# EAGLE design RomeBoardV1.1B (EAGLE 8.6.0)

## Sheet 1 of 4: Power and Regulation
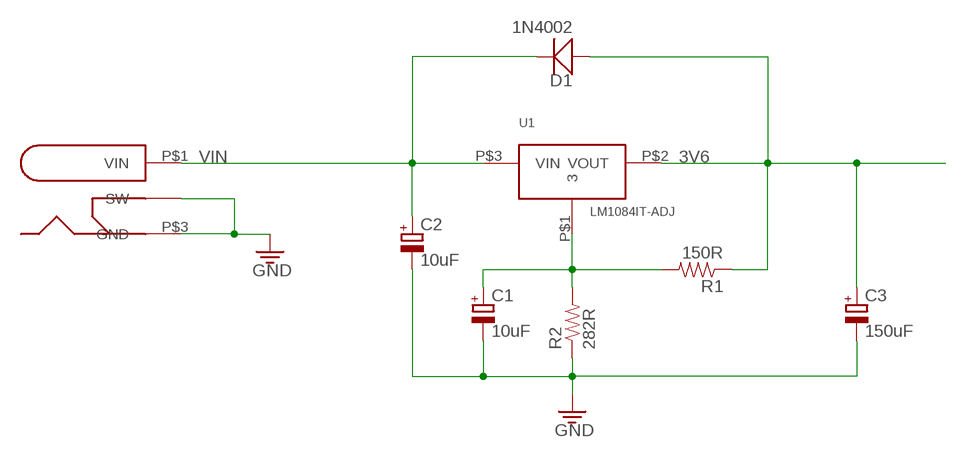
[diagram p0: schematic, sheet 1]

### Parts
C1  10uF  CPOL-EUE2.5-7  [E2,5-7]
C2  10uF  CPOL-EUE2.5-7  [E2,5-7]
C3  150uF  CPOL-EUE5-13  [E5-13]
D1  1N4002  [DO-201AD]
R1  150R  RESISTOR-PTH0.4  [AXIAL-0.4]
R2  282R  RESISTOR-PTH0.4  [AXIAL-0.4]
U1  LM1084IT-ADJ  [TO-220-507302B00000G]
U$2  PJ-002A  [PJ-002A]

### Nets
3V6: C3.+ D1.P$1(A) R1.1 U1.P$2(VOUT) ; also sheet 2,3
GND: C1.- C2.- C3.- R2.1 U$2.P$2(SW) U$2.P$3(GND) ; also sheet 2,3,4
N$8: C1.+ R1.2 R2.2 U1.P$1
VIN: C2.+ D1.P$2(C) U1.P$3(VIN) U$2.P$1(VIN) ; also sheet 2,3,4

## Sheet 2 of 4: Connectors
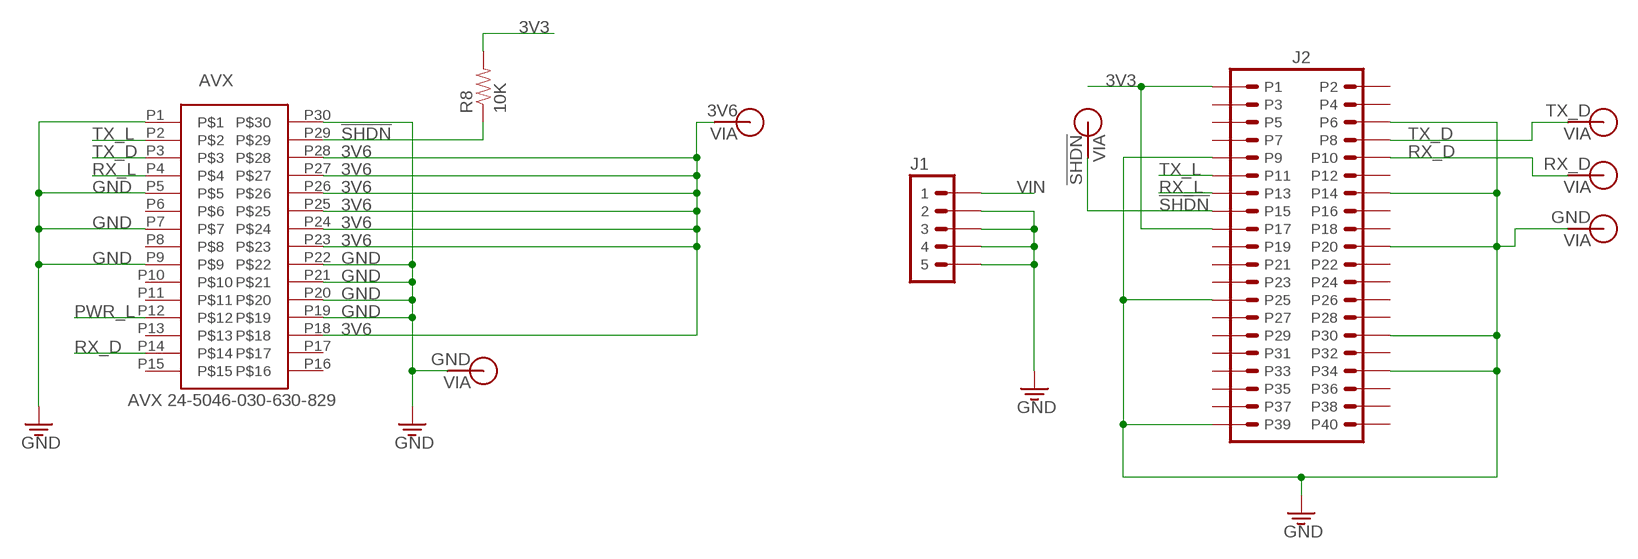
[diagram p1: schematic, sheet 2]

### Parts
AVX  AVX-24-5046-030-630-829  [AVX-24-5046-630-829]
J1  HEADER-5  [HEADER-05]
J2  RASPBERRY-PI-HEADER  [HEADER-20X02]
R8  10K  RESISTOR-PTH0.4  [AXIAL-0.4]
V1  TX_D  VIA-60MIL  [VIA-60MIL]
V2  RX_D  VIA-60MIL  [VIA-60MIL]
V3  GND  VIA-60MIL  [VIA-60MIL]
V4  GND  VIA-120MIL  [VIA-120MIL]
V5  3V6  VIA-120MIL  [VIA-120MIL]
V6  !SHDN  VIA-60MIL  [VIA-60MIL]

### Nets
3V3: J2.P1 J2.P17 R8.2
3V6: AVX.P18 AVX.P23 AVX.P24 AVX.P25 AVX.P26 AVX.P27 AVX.P28 V5.P$1 ; also sheet 1,3
!SHDN: AVX.P29 J2.P15 R8.1 V6.P$1
GND: AVX.P1 AVX.P5 AVX.P7 AVX.P9 AVX.P19 AVX.P20 AVX.P21 AVX.P22 AVX.P30 J1.2 J1.3 J1.4 J1.5 J2.P6 J2.P9 J2.P14 J2.P20 J2.P25 J2.P30 J2.P34 J2.P39 V3.P$1 V4.P$1 ; also sheet 1,3,4
PWR_L: AVX.P12 ; also sheet 3
RX_D: AVX.P14 J2.P10 V2.P$1
RX_L: AVX.P4 J2.P13 ; also sheet 3
TX_D: AVX.P3 J2.P8 V1.P$1
TX_L: AVX.P2 J2.P11 ; also sheet 3
VIN: J1.1 ; also sheet 1,3,4
Unconnected: AVX.P6 AVX.P8 AVX.P10 AVX.P11 AVX.P13 AVX.P15 AVX.P16 AVX.P17 J2.P2 J2.P3 J2.P4 J2.P5 J2.P7 J2.P12 J2.P16 J2.P18 J2.P19 J2.P21 J2.P22 J2.P23 J2.P24 J2.P26 J2.P27 J2.P28 J2.P29 J2.P31 J2.P32 J2.P33 J2.P35 J2.P36 J2.P37 J2.P38 J2.P40

## Sheet 3 of 4: LEDs
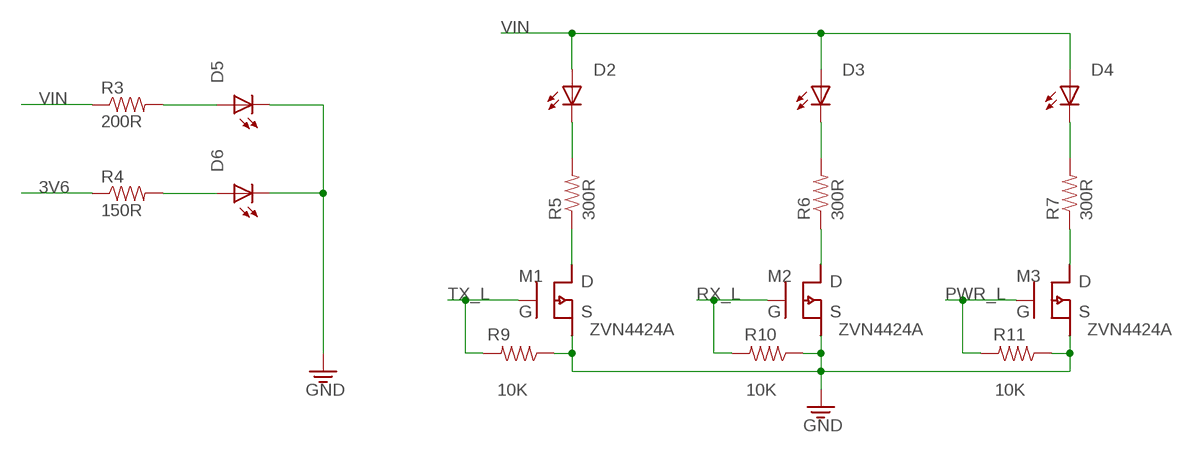
[diagram p2: schematic, sheet 3]

### Parts
D2  LEDTHRU-HOLE-CONNECTOR  [1X2-POL]
D3  LEDTHRU-HOLE-CONNECTOR  [1X2-POL]
D4  LEDTHRU-HOLE-CONNECTOR  [1X2-POL]
D5  LEDTHRU-HOLE-CONNECTOR  [1X2-POL]
D6  LEDTHRU-HOLE-CONNECTOR  [1X2-POL]
M1  ZVN4424A  [TO-923-MOS]
M2  ZVN4424A  [TO-923-MOS]
M3  ZVN4424A  [TO-923-MOS]
R3  200R  RESISTOR-PTH0.4  [AXIAL-0.4]
R4  150R  RESISTOR-PTH0.4  [AXIAL-0.4]
R5  300R  RESISTOR-PTH0.4  [AXIAL-0.4]
R6  300R  RESISTOR-PTH0.4  [AXIAL-0.4]
R7  300R  RESISTOR-PTH0.4  [AXIAL-0.4]
R9  10K  RESISTOR-PTH0.4  [AXIAL-0.4]
R10  10K  RESISTOR-PTH0.4  [AXIAL-0.4]
R11  10K  RESISTOR-PTH0.4  [AXIAL-0.4]

### Nets
3V6: R4.1 ; also sheet 1,2
GND: D5.2(C) D6.2(C) M1.3(S) M2.3(S) M3.3(S) R9.1 R10.1 R11.1 ; also sheet 1,2,4
N$2: D5.1(A) R3.2
N$3: D6.1(A) R4.2
N$4: D3.2(C) R6.2
N$5: M1.1(D) R5.1
N$6: M2.1(D) R6.1
N$7: M3.1(D) R7.1
N$9: D4.2(C) R7.2
N$10: D2.2(C) R5.2
PWR_L: M3.2(G) R11.2 ; also sheet 2
RX_L: M2.2(G) R10.2 ; also sheet 2
TX_L: M1.2(G) R9.2 ; also sheet 2
VIN: D2.1(A) D3.1(A) D4.1(A) R3.1 ; also sheet 1,2,4

## Sheet 4 of 4: Fans
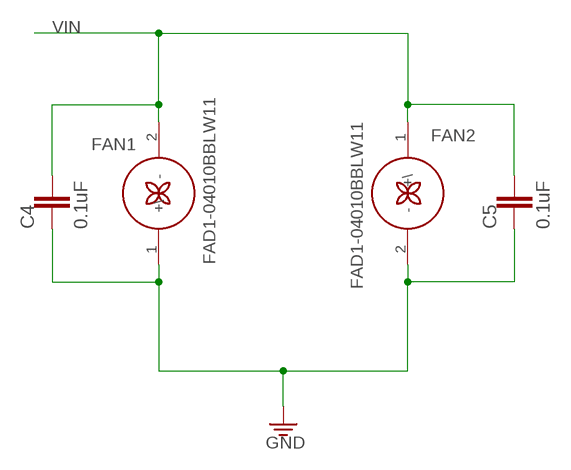
[diagram p3: schematic, sheet 4]

### Parts
C4  0.1uF  CAP5MM-THRU-HOLE  [C050-025X075]
C5  0.1uF  CAP5MM-THRU-HOLE  [C050-025X075]
FAN1  FAD1-04010BBLW11  [1X2-POL]
FAN2  FAD1-04010BBLW11  [1X2-POL]

### Nets
GND: C4.2 C5.2 FAN1.1(+\) FAN2.2(-) ; also sheet 1,2,3
VIN: C4.1 C5.1 FAN1.2(-) FAN2.1(+\) ; also sheet 1,2,3

## Library data of the parts
AVX = CNTRL_BOARD:AVX-24-5046-030-630-829
C1-C3 = resistor:CPOL-EU: POLARIZED CAPACITOR, European symbol
C4 C5 = BrownSpaceEngineering:CAP: Capacitor
D1 = BrownSpaceEngineering:1N4002
D2-D6 = BrownSpaceEngineering:LED
FAN1 FAN2 = BrownSpaceEngineering:FAD1-04010BBLW11
J1 = BrownSpaceEngineering:HEADER-5
J2 = BrownSpaceEngineering:RASPBERRY-PI-HEADER
M1-M3 = BrownSpaceEngineering:ZVN4424A
R1-R11 = passives:RESISTOR: Resistor 0805 <http://www.digikey.com/product-search/en/resistors/chip-resistor-surface-mount/65769?FV=fffc000a%2C80005%2Cc0002%2C1c0002%2C400006%2C52403b5%2Cfff40001%2Cfff800e9&mnonly=0&newproducts=0&ColumnSort=1000011&page=1&stock=1&pbfree=1&rohs=1&k=&quantity=1&ptm=0&fid=0&pageSize=500>
U1 = BrownSpaceEngineering:LM1084IT-ADJ
U$2 = BrownSpaceEngineering:PJ-002A
V1-V6 = BrownSpaceEngineering:VIA

## Board
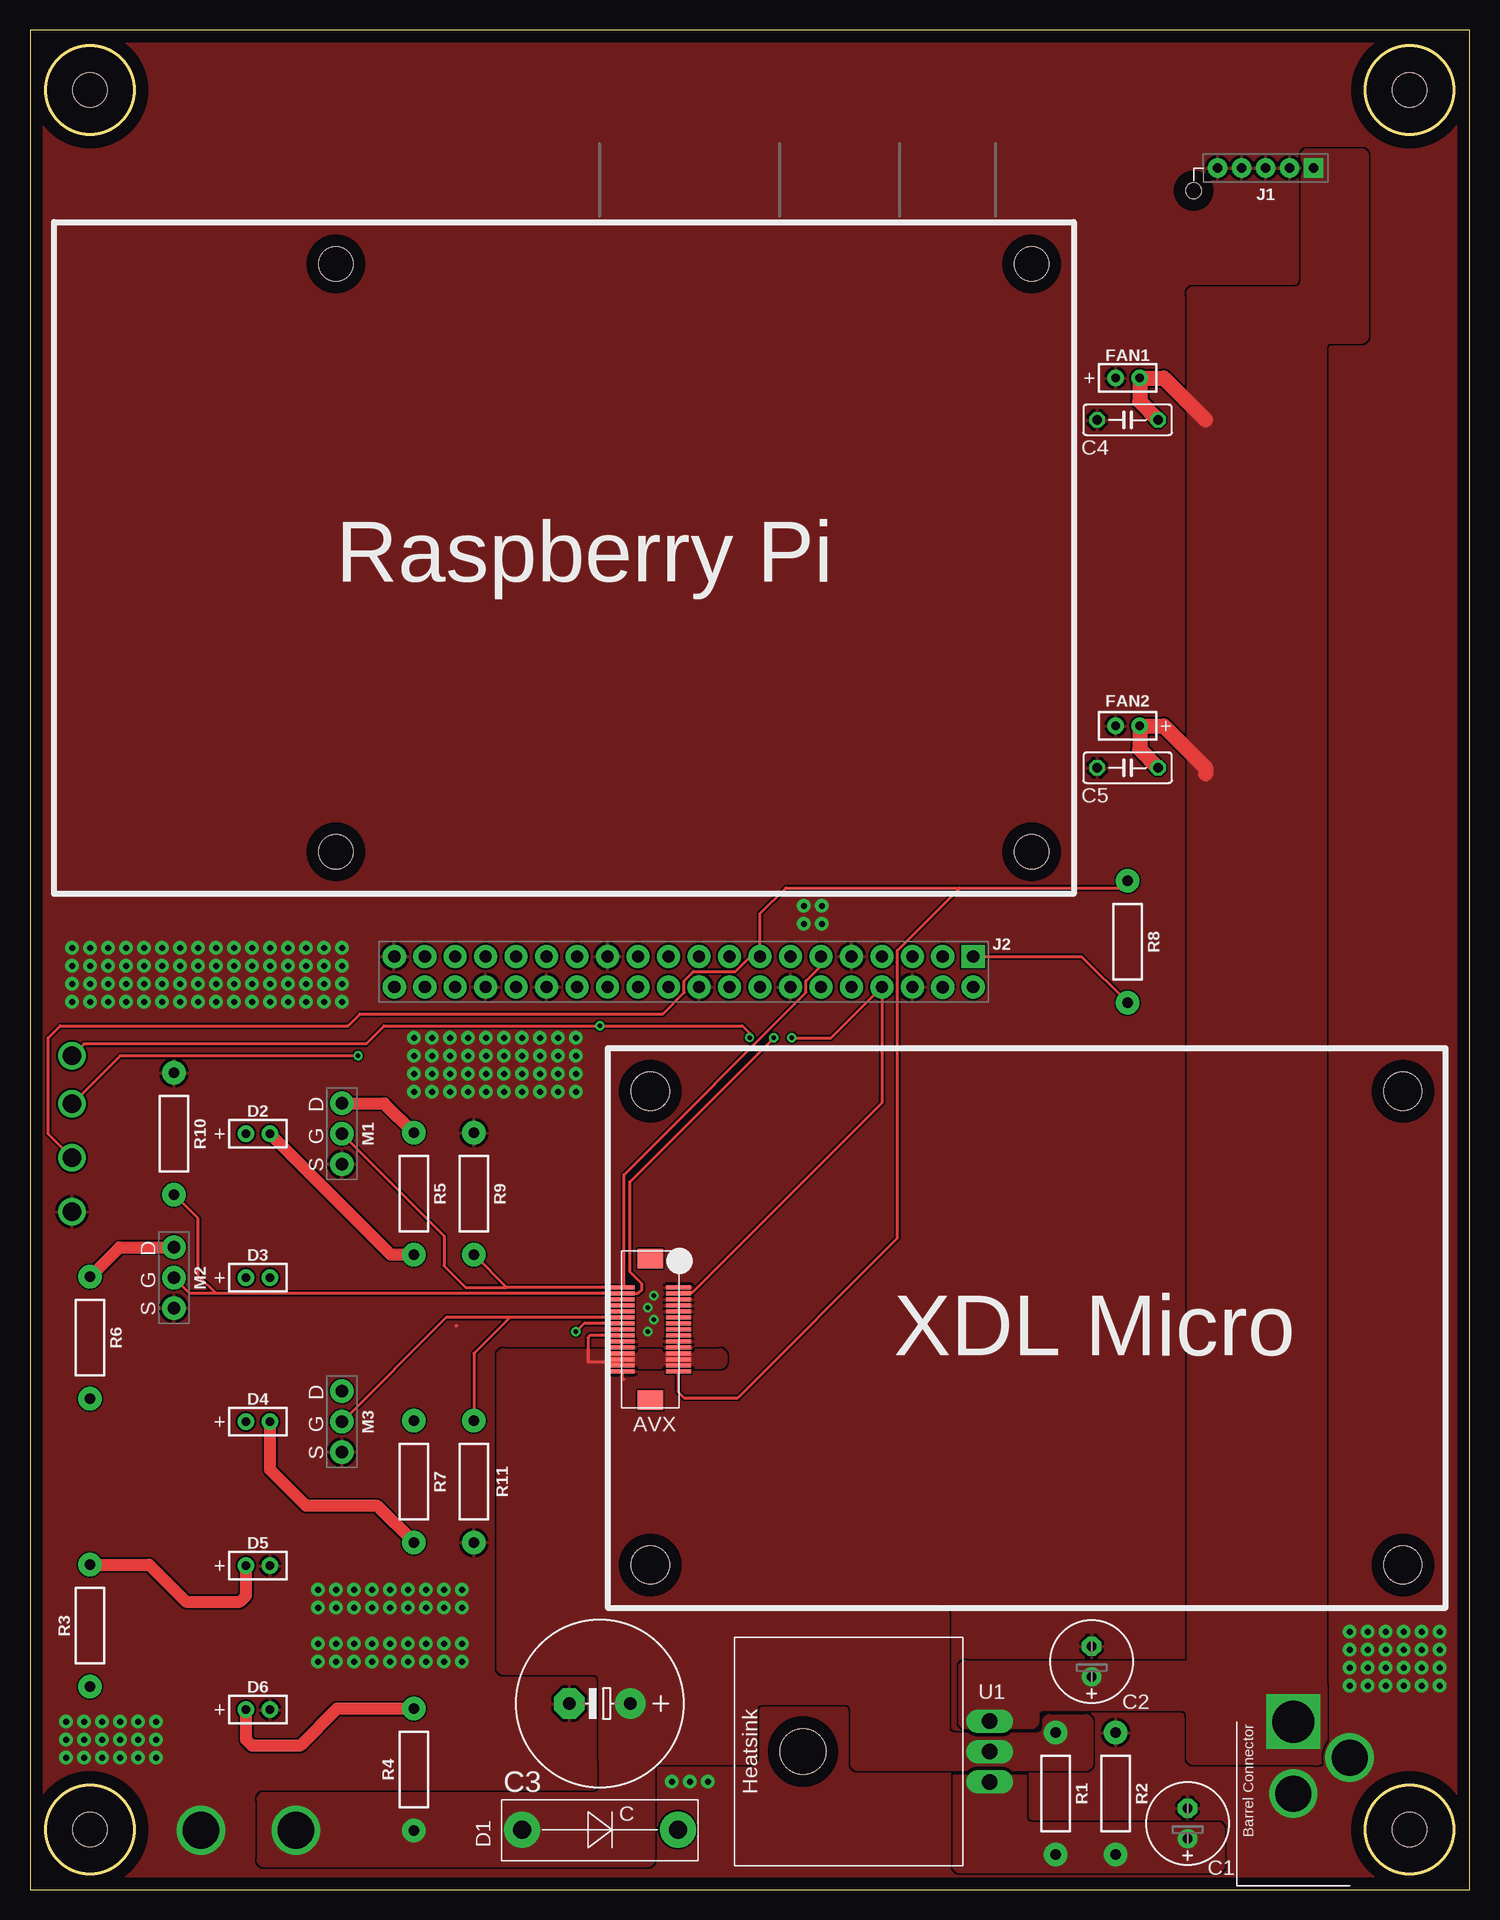
[diagram p4: board, top side]
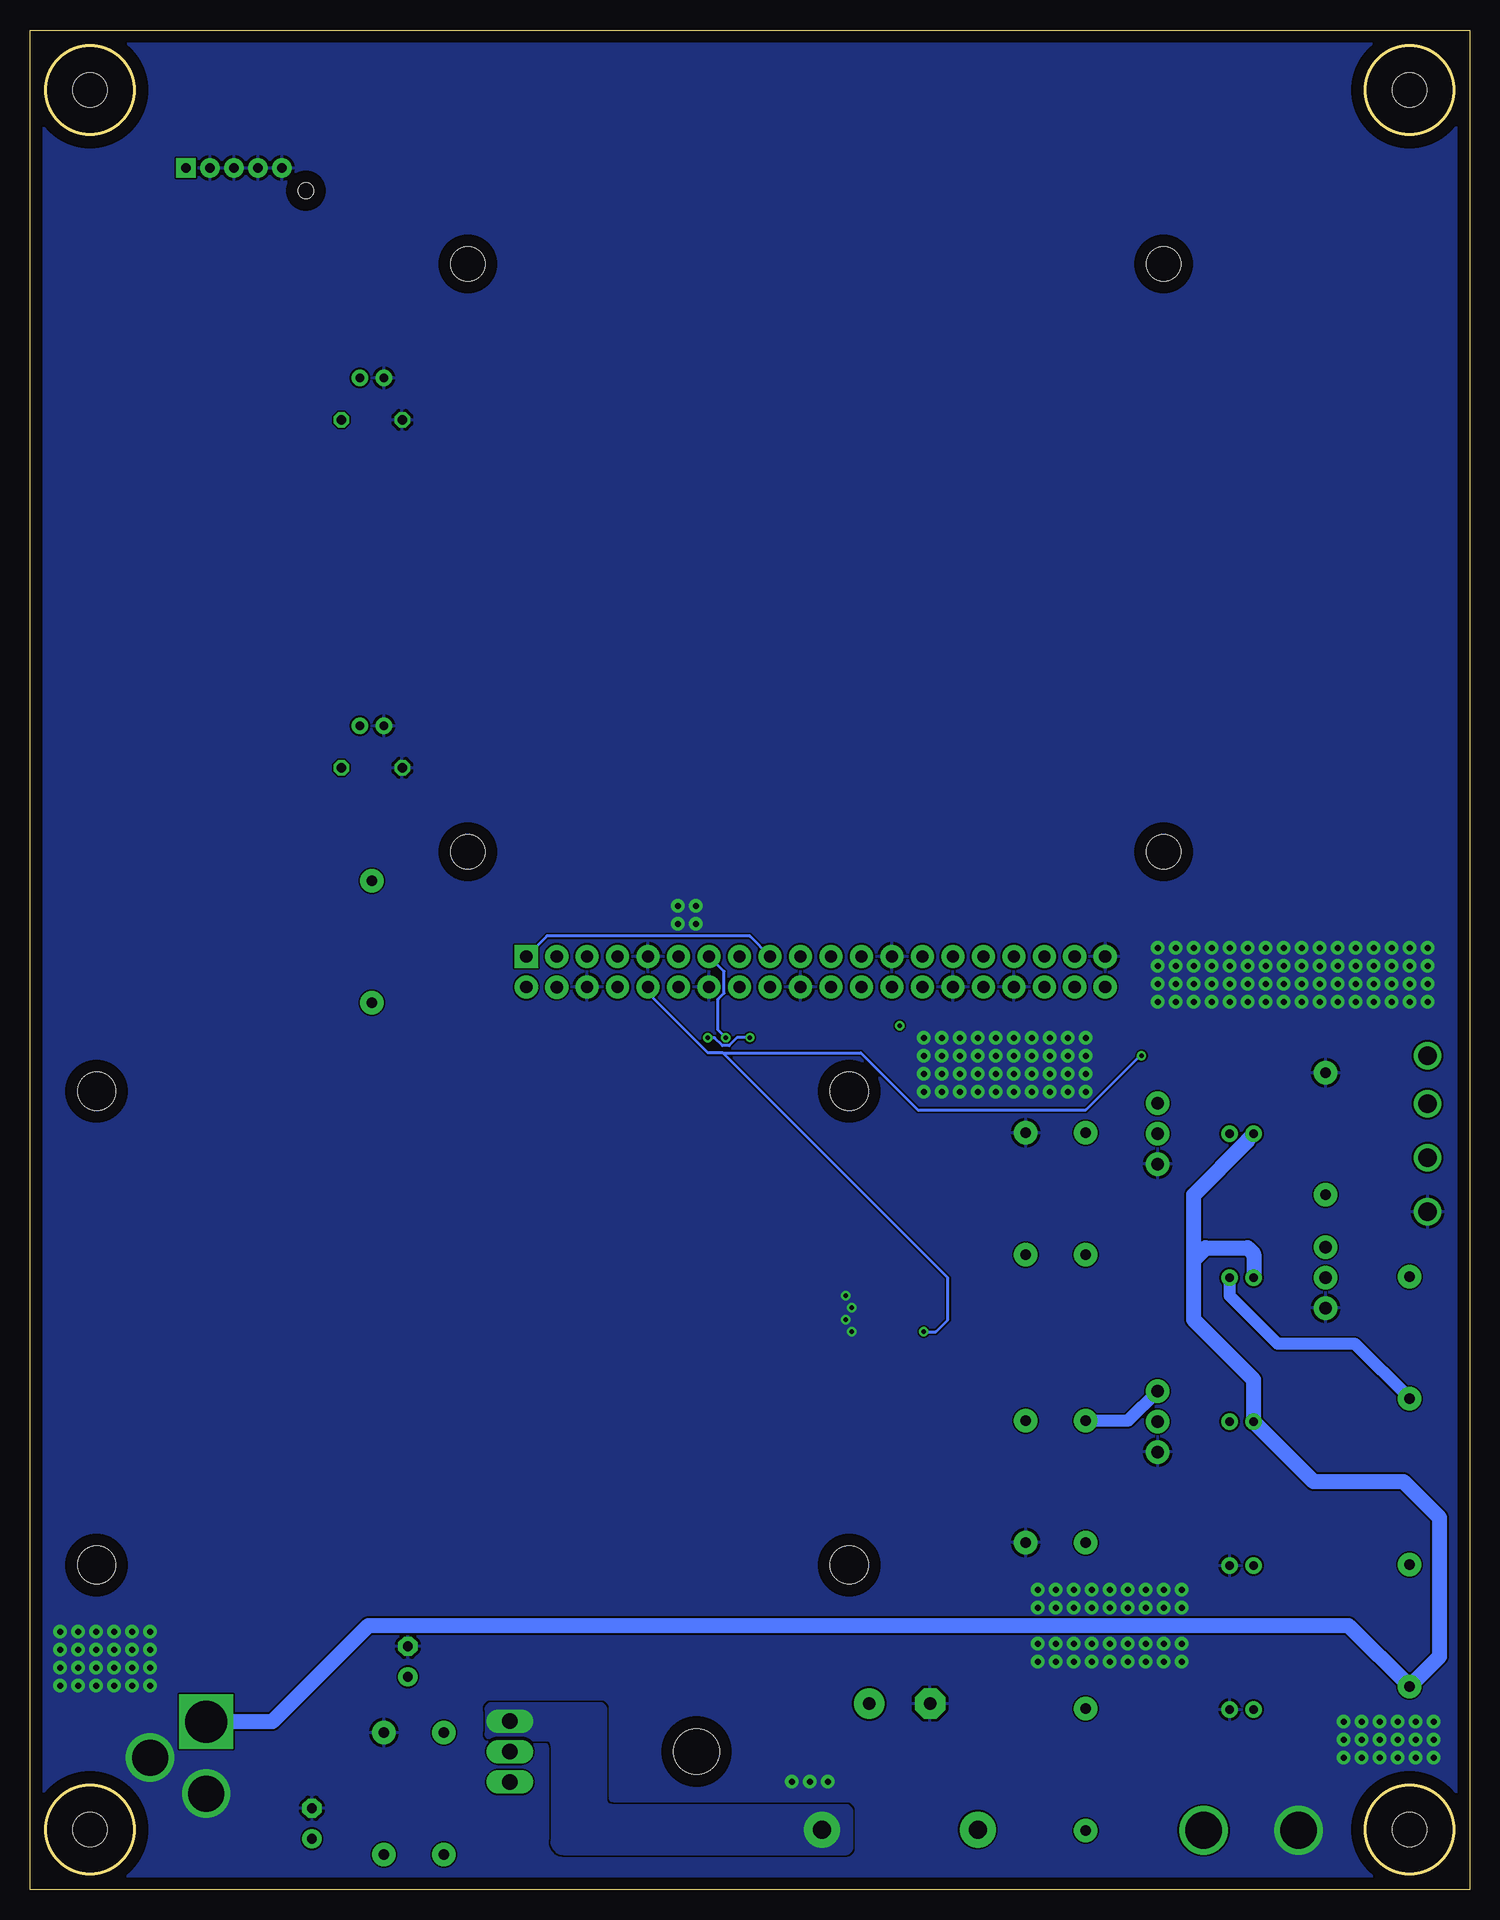
[diagram p5: board, bottom side, seen from below]

Size 120 x 155 mm. Coordinates in mm from the lower left corner, seen from the top.
Outline: 0,0 120,0 120,155 0,155 0,0
Outline: circle at 115,150 radius 3.7
Outline: circle at 5,150 radius 3.7
Outline: circle at 115,5 radius 3.7
Outline: circle at 5,5 radius 3.7
Copper layers (1*16): Top 0.035mm / dielectric 1.5mm / Bottom 0.035mm
Design rules "default *": minimum track width 6mil, minimum drill 0.35mm, track to track 6mil, track to pad 6mil, pad to pad 6mil, via to via 6mil, smd to smd 6mil, copper to edge 40mil, drill to drill 6mil, minimum pad ring 10mil, minimum via ring 8mil, stop-mask expansion 4mil, vias tented up to drill 0mil, thermal gap 10mil
Holes 2.84 mm at 25.5,135.5 83.5,135.5 25.5,86.5 83.5,86.5 5,5 115,5 5,150 115,150
Holes 3.18 mm at 51.71,66.55 114.44,66.55 51.71,27.06 114.44,27.06

### Footprints (pad centres in the part's own frame; a part is rotated, then mirrored left to right if it is on the bottom)
AVX-24-5046-630-829 = smd 0.3 x 2.1: P1 -3.45,2.35; P2 -3.45,-2.35; P3 -2.95,2.35; P4 -2.95,-2.35; P5 -2.45,2.35; P6 -2.45,-2.35; P7 -1.95,2.35; P8 -1.95,-2.35; P9 -1.45,2.35; P10 -1.45,-2.35; P11 -0.95,2.35; P12 -0.95,-2.35; P13 -0.45,2.35; P14 -0.45,-2.35; P15 0.05,2.35; P16 0.05,-2.35; P17 0.55,2.35; P18 0.55,-2.35; P19 1.05,2.35; P20 1.05,-2.35; P21 1.55,2.35; P22 1.55,-2.35; P23 2.05,2.35; P24 2.05,-2.35; P25 2.55,2.35; P26 2.55,-2.35; P27 3.05,2.35; P28 3.05,-2.35; P29 3.55,2.35; P30 3.55,-2.35 | smd 1.6 x 2.1: P31 -5.85,0; P32 5.95,0
E2,5-7 = drill 0.813 pad 1.6: + -1.27,0 | drill 0.813 pad 1.6 octagon: - 1.27,0
E5-13 = drill 1.016 pad 2.54: + -2.54,0 | drill 1.016 pad 2.54 octagon: - 2.54,0
C050-025X075 = drill 0.813 octagon: 1 -2.54,0; 2 2.54,0
DO-201AD = drill 1.5 pad 3: P$1 -6.5,0; P$2 6.5,0
1X2-POL = drill 0.7 pad 1.4: 1 -1,0; 2 1,0
HEADER-05 = drill 0.8 pad 1.6 square: 1 -4,0 | drill 0.8 pad 1.6: 2 -2,0; 3 0,0; 4 2,0; 5 4,0 | hole 1.3: 6,1.9
HEADER-20X02 = drill 1.016 pad 1.93 square: P1 -1.27,24.13 | drill 1.016 pad 1.93: P2 1.27,24.13; P3 -1.27,21.59; P4 1.292,21.59; P5 -1.27,19.05; P6 1.27,19.05; P7 -1.27,16.51; P8 1.27,16.51; P9 -1.27,13.97; P10 1.27,13.97; P11 -1.27,11.43; P12 1.27,11.43; P13 -1.27,8.89; P14 1.27,8.89; P15 -1.27,6.35; P16 1.27,6.35; P17 -1.27,3.81; P18 1.27,3.81; P19 -1.27,1.27; P20 1.27,1.27; P21 -1.27,-1.27; P22 1.27,-1.27; P23 -1.27,-3.81; P24 1.27,-3.81; P25 -1.27,-6.35; P26 1.27,-6.35; P27 -1.27,-8.89; P28 1.27,-8.89; P29 -1.27,-11.43; P30 1.27,-11.43; P31 -1.27,-13.97; P32 1.27,-13.97; P33 -1.27,-16.51; P34 1.27,-16.51; P35 -1.27,-19.05; P36 1.27,-19.05; P37 -1.27,-21.59; P38 1.27,-21.59; P39 -1.27,-24.13; P40 1.27,-24.13
TO-923-MOS = drill 1.016 pad 1.93: 1 -2.54,0; 2 0,0; 3 2.54,0
AXIAL-0.4 = drill 0.9 pad 1.93: 1 -5.08,0; 2 5.08,0
TO-220-507302B00000G = drill 1.3 long: P$1 -2.54,0; P$2 0,0; P$3 2.54,0 | hole 3.81: 0,15.55
PJ-002A = drill 3.5 square: P$1 -3,-4.7 | drill 3: P$2 3,-4.7; P$3 0,0
VIA-60MIL = drill 1.524: P$1 0,0
VIA-120MIL = drill 3.048: P$1 0,0

### Placement (x,y rotation side)
AVX  51.71,46.74 270 top
C1  96.5,5.5 90 top
C2  88.5,19 90 top
C3  47.5,15.5 180 top
C4  91.5,122.5 180 top
C5  91.5,93.5 180 top
D1  47.5,5 0 top
D2  19,63 0 top
D3  19,51 0 top
D4  19,39 0 top
D5  19,27 0 top
D6  19,15 0 top
FAN1  91.5,126 0 top
FAN2  91.5,97 180 top
J1  103,143.5 180 top
J2  54.5,76.5 270 top
M1  26,63 270 top
M2  12,51 270 top
M3  26,39 270 top
R1  85.5,8 270 top
R2  90.5,8 270 top
R3  5,22 90 top
R4  32,10 90 top
R5  32,58 270 top
R6  5,46 270 top
R7  32,34 270 top
R8  91.5,79 270 top
R9  37,58 270 top
R10  12,63 270 top
R11  37,34 90 top
U1  80,11.5 90 top
U$2  110,11 270 top
V1  3.5,69.5 0 top
V2  3.5,65.5 0 top
V3  3.5,56.5 0 top
V4  14.25,4.94 0 top
V5  22.17,4.94 0 top
V6  3.5,61 0 top

### Tracks (layer width: path | path; a pad name or v marks a point on that pad's centre or on a via)
3V3
  Top 0.254: 78.63,78.1 J2.P1 87.65,77.77 R8.2
  Bottom 0.254: J2.P17 60,79.46 60,79.5 76.9,79.5 J2.P1
3V6
  Top 0.254: AVX.P28 AVX.P26 49.17,44 46.5,44 46.5,46 46.69,46.19 AVX.P18
  Top 1.016: 32.42,4.92 R4.1
  pour Top (isolate 0.305, rank 2, no thermals): 82.5,10 69,10 arc-90 68.5,10.5 68.5,15 arc90 68,15.5 61,15.5 arc90 60.5,15 60.5,11 arc-90 60,10.5 48,10.5 arc-90 47.5,11 47.5,17.5 arc90 47,18 39.5,18 arc-90 39,18.5 39,44.5 arc-90 39.5,45 57.5,45 arc-90 58,44.5 58,44 arc-90 57.5,43.5 48.5,43.5 arc90 48,43 48,24 arc90 48.5,23.5 76,23.5 arc-90 76.5,23 76.5,13.5 arc90 77,13 82.5,13 arc90
  pour Top (isolate 0.305, no thermals): 77,13 84,13 arc90 84.5,13.5 84.5,14 arc-90 85,14.5 88,14.5 arc-90 88.5,14 88.5,10.5 arc-90 88,10 77,10 arc-90 76.5,10.5 76.5,12.5 arc-90
  pour Top (isolate 0.305, no thermals): 21,8 19.5,8 arc90 19,7.5 19,2.5 arc90 19.5,2 51.5,2 arc90 52,2.5 52,10.5 52,12 arc90 51.5,12.5 48,12.5 arc90 47.5,12 47.5,9 47.5,8.5 arc-90 47,8
!SHDN
  Top 0.254: AVX.P29 54,43.13 54,41.5 54.5,41 59,41 72.31,54.3 72.31,78.29 77.52,83.5 | 61.35,77.77 J2.P15 | J2.P15 60.85,81.35 63,83.5 77.52,83.5 | R8.1 90.92,83.5 77.52,83.5 | V6.P$1 1.5,63 1.5,71 2.5,72 26.5,72 27.5,73 52.76,73 54.52,74.77 54.52,75.75 55.3,76.53 58.83,76.53 60.07,77.77 J2.P15
GND  (via drill 0.35, 0.5 pad 1.1)
  Top 0.254: 35.5,47 35.57,47 | AVX.P21 AVX.P19 | AVX.P22 AVX.P20 | AVX.P30 49.36,42.64 49.5,42.5
  other vias: 32,66.5 33.5,66.5 35,66.5 36.5,66.5 38,66.5 39.5,66.5 41,66.5 42.5,66.5 44,66.5 45.5,66.5 45.5,68 44,68 42.5,68 41,68 39.5,68 38,68 36.5,68 35,68 33.5,68 32,68 32,69.5 33.5,69.5 35,69.5 36.5,69.5 38,69.5 39.5,69.5 41,69.5 42.5,69.5 44,69.5 45.5,69.5 45.5,71 44,71 42.5,71 41,71 39.5,71 38,71 36.5,71 35,71 33.5,71 32,71 24,25 25.5,25 27,25 28.5,25 31.5,25 33,25 34.5,25 36,25 30,25 24,23.5 27,23.5 28.5,23.5 25.5,23.5 30,23.5 31.5,23.5 34.5,23.5 33,23.5 36,23.5 36,20.5 34.5,20.5 33,20.5 31.5,20.5 30,20.5 28.5,20.5 27,20.5 25.5,20.5 24,20.5 24,19 25.5,19 27,19 28.5,19 30,19 31.5,19 33,19 34.5,19 36,19 4.5,14 6,14 3,14 7.5,14 9,14 10.5,14 3,12.5 4.5,12.5 7.5,12.5 9,12.5 6,12.5 10.5,12.5 10.5,11 9,11 7.5,11 6,11 4.5,11 3,11 52,49.5 51.5,48.5 52,47.5 51.5,46.5 18.5,74 20,74 21.5,74 23,74 24.5,74 18.5,77 20,77 21.5,77 23,77 24.5,77 24.5,78.5 23,78.5 21.5,78.5 20,78.5 18.5,78.5 24.5,75.5 23,75.5 21.5,75.5 20,75.5 18.5,75.5 64.5,80.5 66,80.5 66,82 64.5,82 11,74 12.5,74 14,74 15.5,74 17,74 11,77 12.5,77 14,77 15.5,77 17,77 17,78.5 15.5,78.5 14,78.5 12.5,78.5 11,78.5 17,75.5 15.5,75.5 14,75.5 12.5,75.5 11,75.5 3.5,74 5,74 6.5,74 8,74 9.5,74 3.5,77 5,77 6.5,77 8,77 9.5,77 9.5,78.5 8,78.5 6.5,78.5 5,78.5 3.5,78.5 9.5,75.5 8,75.5 6.5,75.5 5,75.5 3.5,75.5 26,74 26,77 26,78.5 26,75.5 53.5,9 55,9 56.5,9 110,21.5 111.5,21.5 113,21.5 114.5,21.5 116,21.5 117.5,21.5 116,20 117.5,20 114.5,20 113,20 111.5,20 110,20 110,18.5 111.5,18.5 113,18.5 114.5,18.5 116,18.5 117.5,18.5 117.5,17 116,17 114.5,17 113,17 111.5,17 110,17
  pour Top (rank 6): 0,155 120,155 120,0 0,0
  pour Bottom (rank 6): 0,0 120,0 120,155 0,155
  pour Top (no thermals): 16.5,8 12,8 arc90 11.5,7 11.5,2.5 arc90 12,2 16.5,2 arc90 17,2.5 17,7.5 arc90
  pour Bottom (no thermals): 14,8 16.5,8 arc-90 17,7.5 17,2.5 arc-90 16.5,2 12,2 arc-90 11.5,2.5 11.5,7.5 arc-90 12,8
N$2
  Top 1: R3.2 9.92,27.08 13,24 17.5,24 18,24.5 D5.1
N$3
  Top 1: R4.2 25.58,15.08 22.5,12 18.5,12 18,12.5 D6.1
N$4
  Bottom 1: R6.2 9.58,45.5 16,45.5 20,49.5 D3.2
N$5
  Top 1: M1.1 29.54,65.54 R5.1
N$6
  Top 1: R6.1 7.46,53.54 M2.1
N$7
  Bottom 1: M3.1 28.46,39.08 R7.1
N$8
  pour Top (isolate 0.305, rank 3, no thermals): 79,10 77.5,10 arc90 77,9.5 77,2 arc90 77.5,1.5 99,1.5 arc90 99.5,2 99.5,5 arc90 99,5.5 83.5,5.5 arc-90 83,6 83,9.5 arc90 82.5,10
N$9
  Top 1: R7.2 28.92,32 23,32 20,35 D4.2
N$10
  Top 1: D2.2 30.08,52.92 R5.2
PWR_L
  Top 0.254: AVX.P12 40,47.69 | 40,47.69 34.69,47.69 M3.2 | 40,47.69 37,44.69 R11.2
RX_D  (via drill 0.35)
  Top 0.254: AVX.P14 46.19,47.19 v45.5,46.5 | V2.P$1 7.5,69.5 v27.34,69.5
  Bottom 0.254: v45.5,46.5 44.5,46.5 43.5,47.5 43.5,51 62.25,69.75 | 62.25,69.75 50.75,69.75 46,65 32,65 27.5,69.5 v27.34,69.5 | 62.25,69.75 63.49,69.75 68.47,74.73 J2.P10
RX_L  (via drill 0.35)
  Top 0.254: M2.2 13.31,49.69 15.5,49.69 | 15.5,49.69 AVX.P4 50.69,49.69 51,50 51,50.5 50,51.5 50,59 v62,71 | 15.5,49.69 14.19,51 14,51 14,55.92 R10.2
  Bottom 0.254: 62.15,71.14 v62,71 62.65,71.64 62.65,74.21 62.15,74.71 62.15,76.53 J2.P13
TX_D  (via drill 0.35)
  Top 0.254: AVX.P3 54.13,49.76 55.23,49.76 71.01,65.55 J2.P8 66.78,71 v63.5,71 | v59.99,71 59.99,71.39 59.38,72 v47.5,72 29.5,72 28,70.5 4.5,70.5 V1.P$1
  Bottom 0.254: v59.99,71 61.06,71 61.73,70.34 62.27,70.34 62.93,71 v63.5,71
TX_L
  Top 0.254: 39.73,50.19 AVX.P2 49.5,50.33 49.5,59.58 64.69,74.77 64.69,75.75 65.93,76.99 J2.P11 | M1.2 34.5,54.5 34.5,52 36.31,50.19 39.73,50.19 | R9.2 39.73,50.19
VIN
  Top 1.27: 98,122.5 94.5,126 FAN1.2 92.5,124.04 C4.1 | 98,93 98,93.5 94.5,97 FAN2.1 92.5,95.04 C5.1
  Bottom 1.27: D2.1 18.51,62.49 18.51,62.38 23,57.9 23,52.5 | 23,52.5 23,47.5 18,42.5 D4.1 13,34 5.5,34 2.5,31 2.5,19.42 R3.1 10.08,22 91.8,22 99.8,14 U$2.P$1 | 23,52.5 22,53.5 18.5,53.5 18,53 D3.1
  pour Bottom (isolate 0.305, no thermals): 80,12.5 77,12.5 arc90 76.5,12 76.5,4 arc-90 75.5,3 52,3 arc-90 51.5,3.5 51.5,6.5 arc-90 52,7 71.5,7 arc90 72,7.5 72,15 arc-90 72.5,15.5 81.5,15.5 arc-90 82,15 82,13 arc-90 81.5,12.5
  pour Top (isolate 0.305, no thermals): 107,10.5 97,10.5 arc-90 96.5,11 96.5,14.5 arc90 96,15 84.5,15 arc90 84,14.5 84,14 arc-90 83.5,13.5 78,13.5 arc-90 77.5,14 77.5,18.5 arc-90 78,19 99,19 arc-90 99.5,18.5 99.5,18 arc90 100,17.5 107.5,17.5 arc-90 108,17 108,11 arc-90
  pour Top (isolate 0.305, no thermals): 108,17 108,128.5 arc-90 108.5,129 111,129 arc90 111.5,129.5 111.5,144.5 arc90 111,145 106.5,145 arc90 106,144.5 106,134 arc-90 105.5,133.5 97,133.5 arc90 96.5,133 96.5,18 arc-90 96,17.5 arc90 97.5,17 arc90 98,16.5 107.5,16.5 arc90

### Text on the board
tPlace: Raspberry Pi | XDL Micro
tDocu: BROWN SPACE ENGINEERING GROUND STATION | Pi Power | HDMI / Out | USB / Power / In | Brown U. / Providence, R.I. / U.S.A. / / V1.1 / April 2018 | Viviana Arrunategui / Mckenna Cisler / Tyler Fox / Manav Kohli / Teijiro Nishimura / Caelan Ritter | Che piacere / vederti! | Raspberry Pi 3 Model B | Ribbon cable for Raspberry Pi | board design by M. Kohli '18 | TX | RX | Radio Power | 5V | XDL Micro: 435.55MHz | 5V in | 3.6V